# EAGLE schematic SynthV1 (EAGLE 9.3.2)
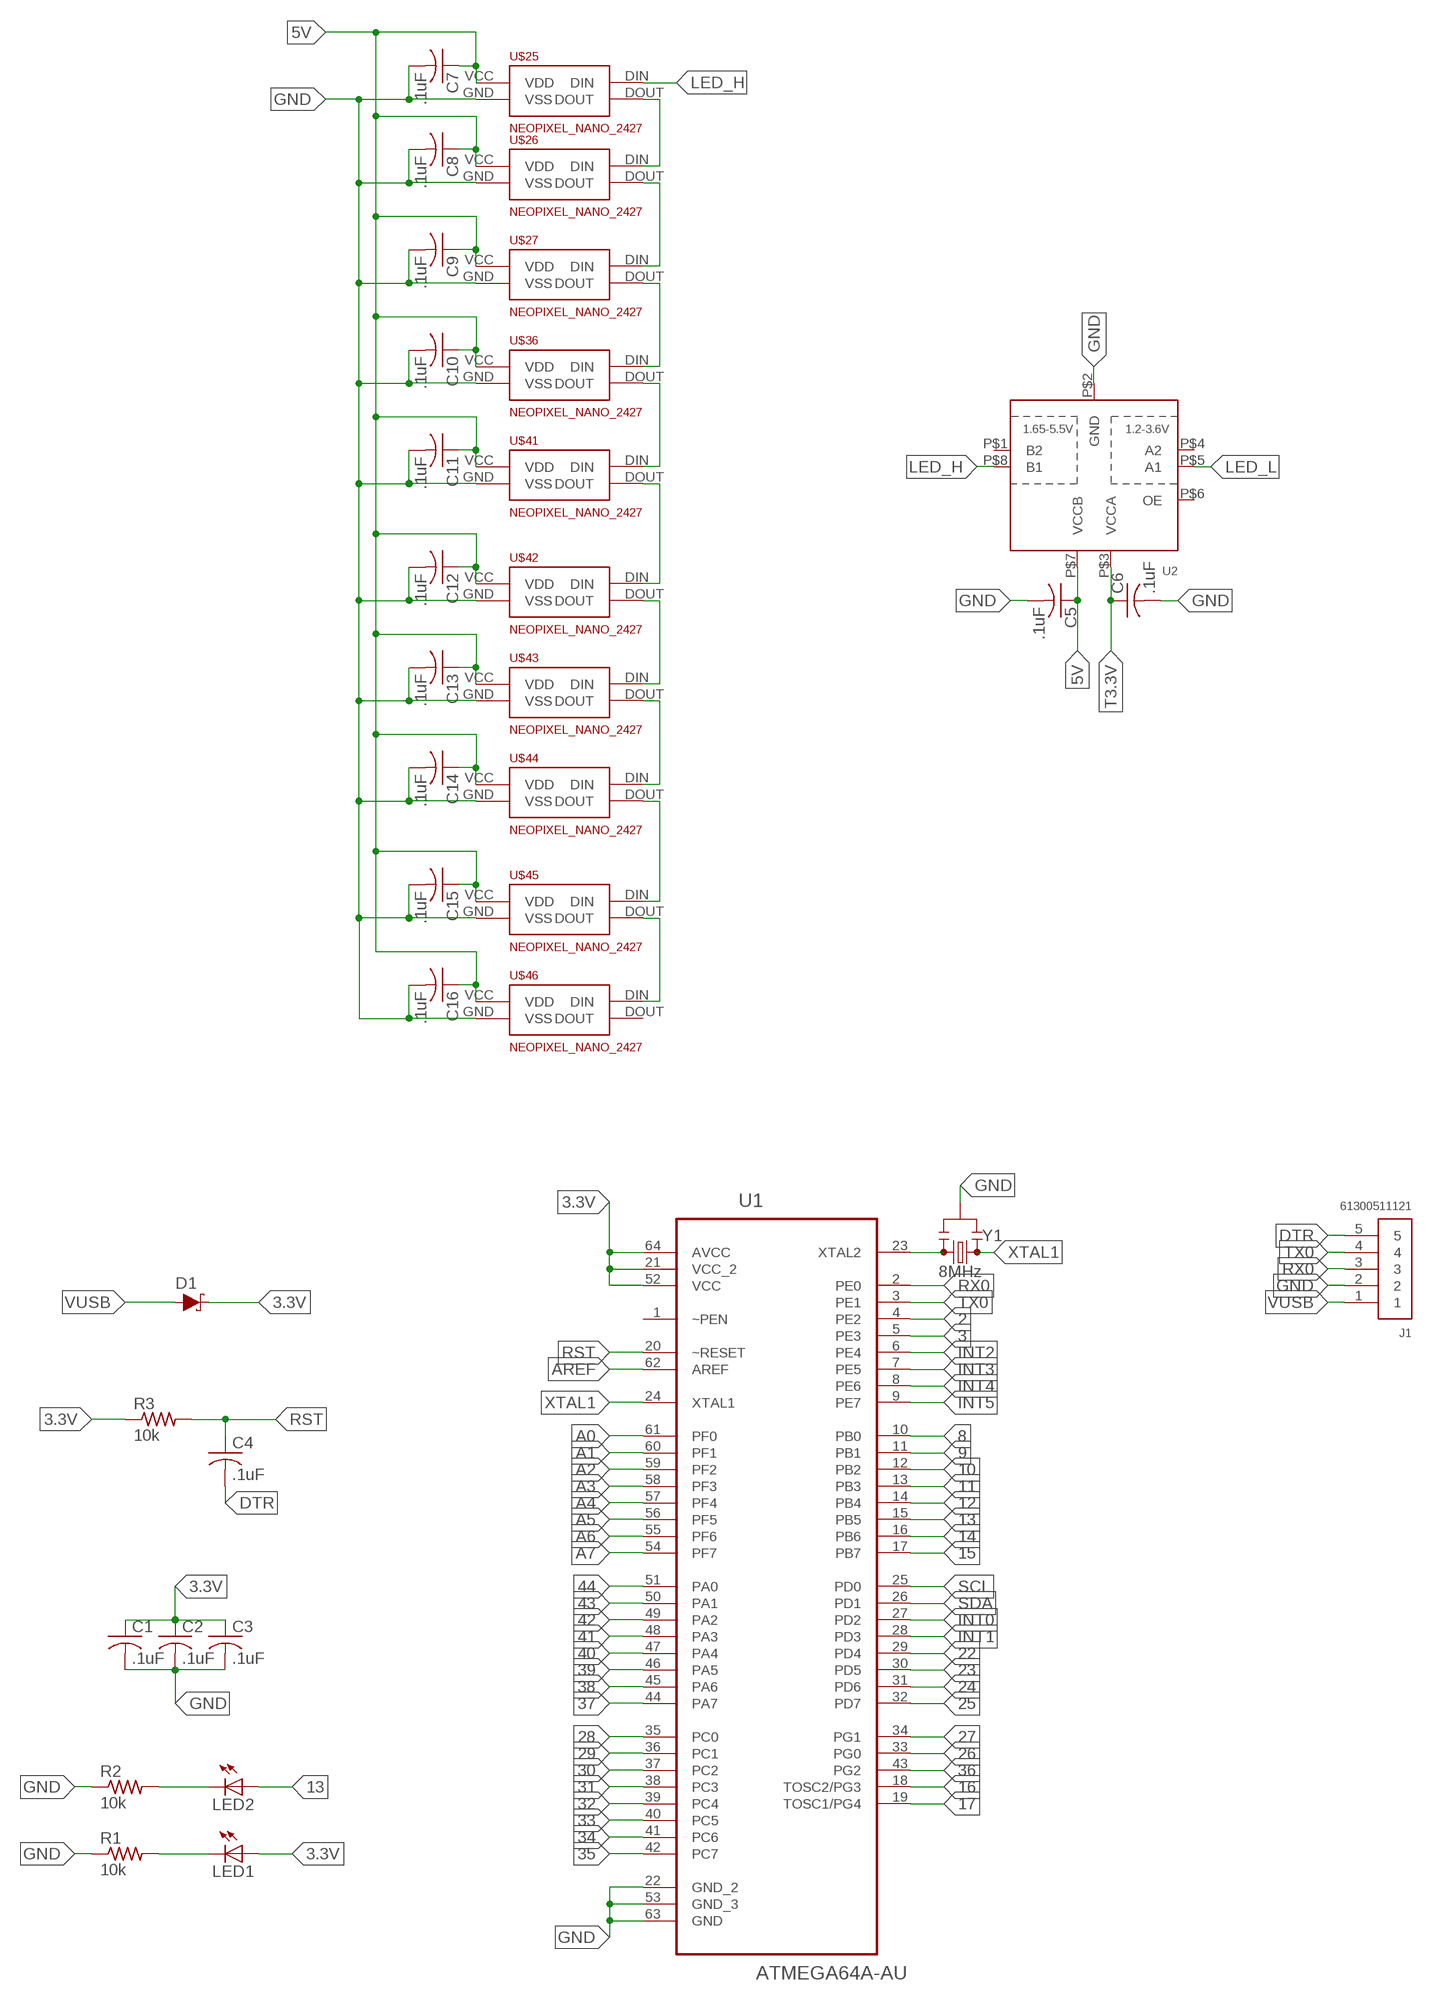
[diagram p0: schematic, sheet 1, part 1 of 2]
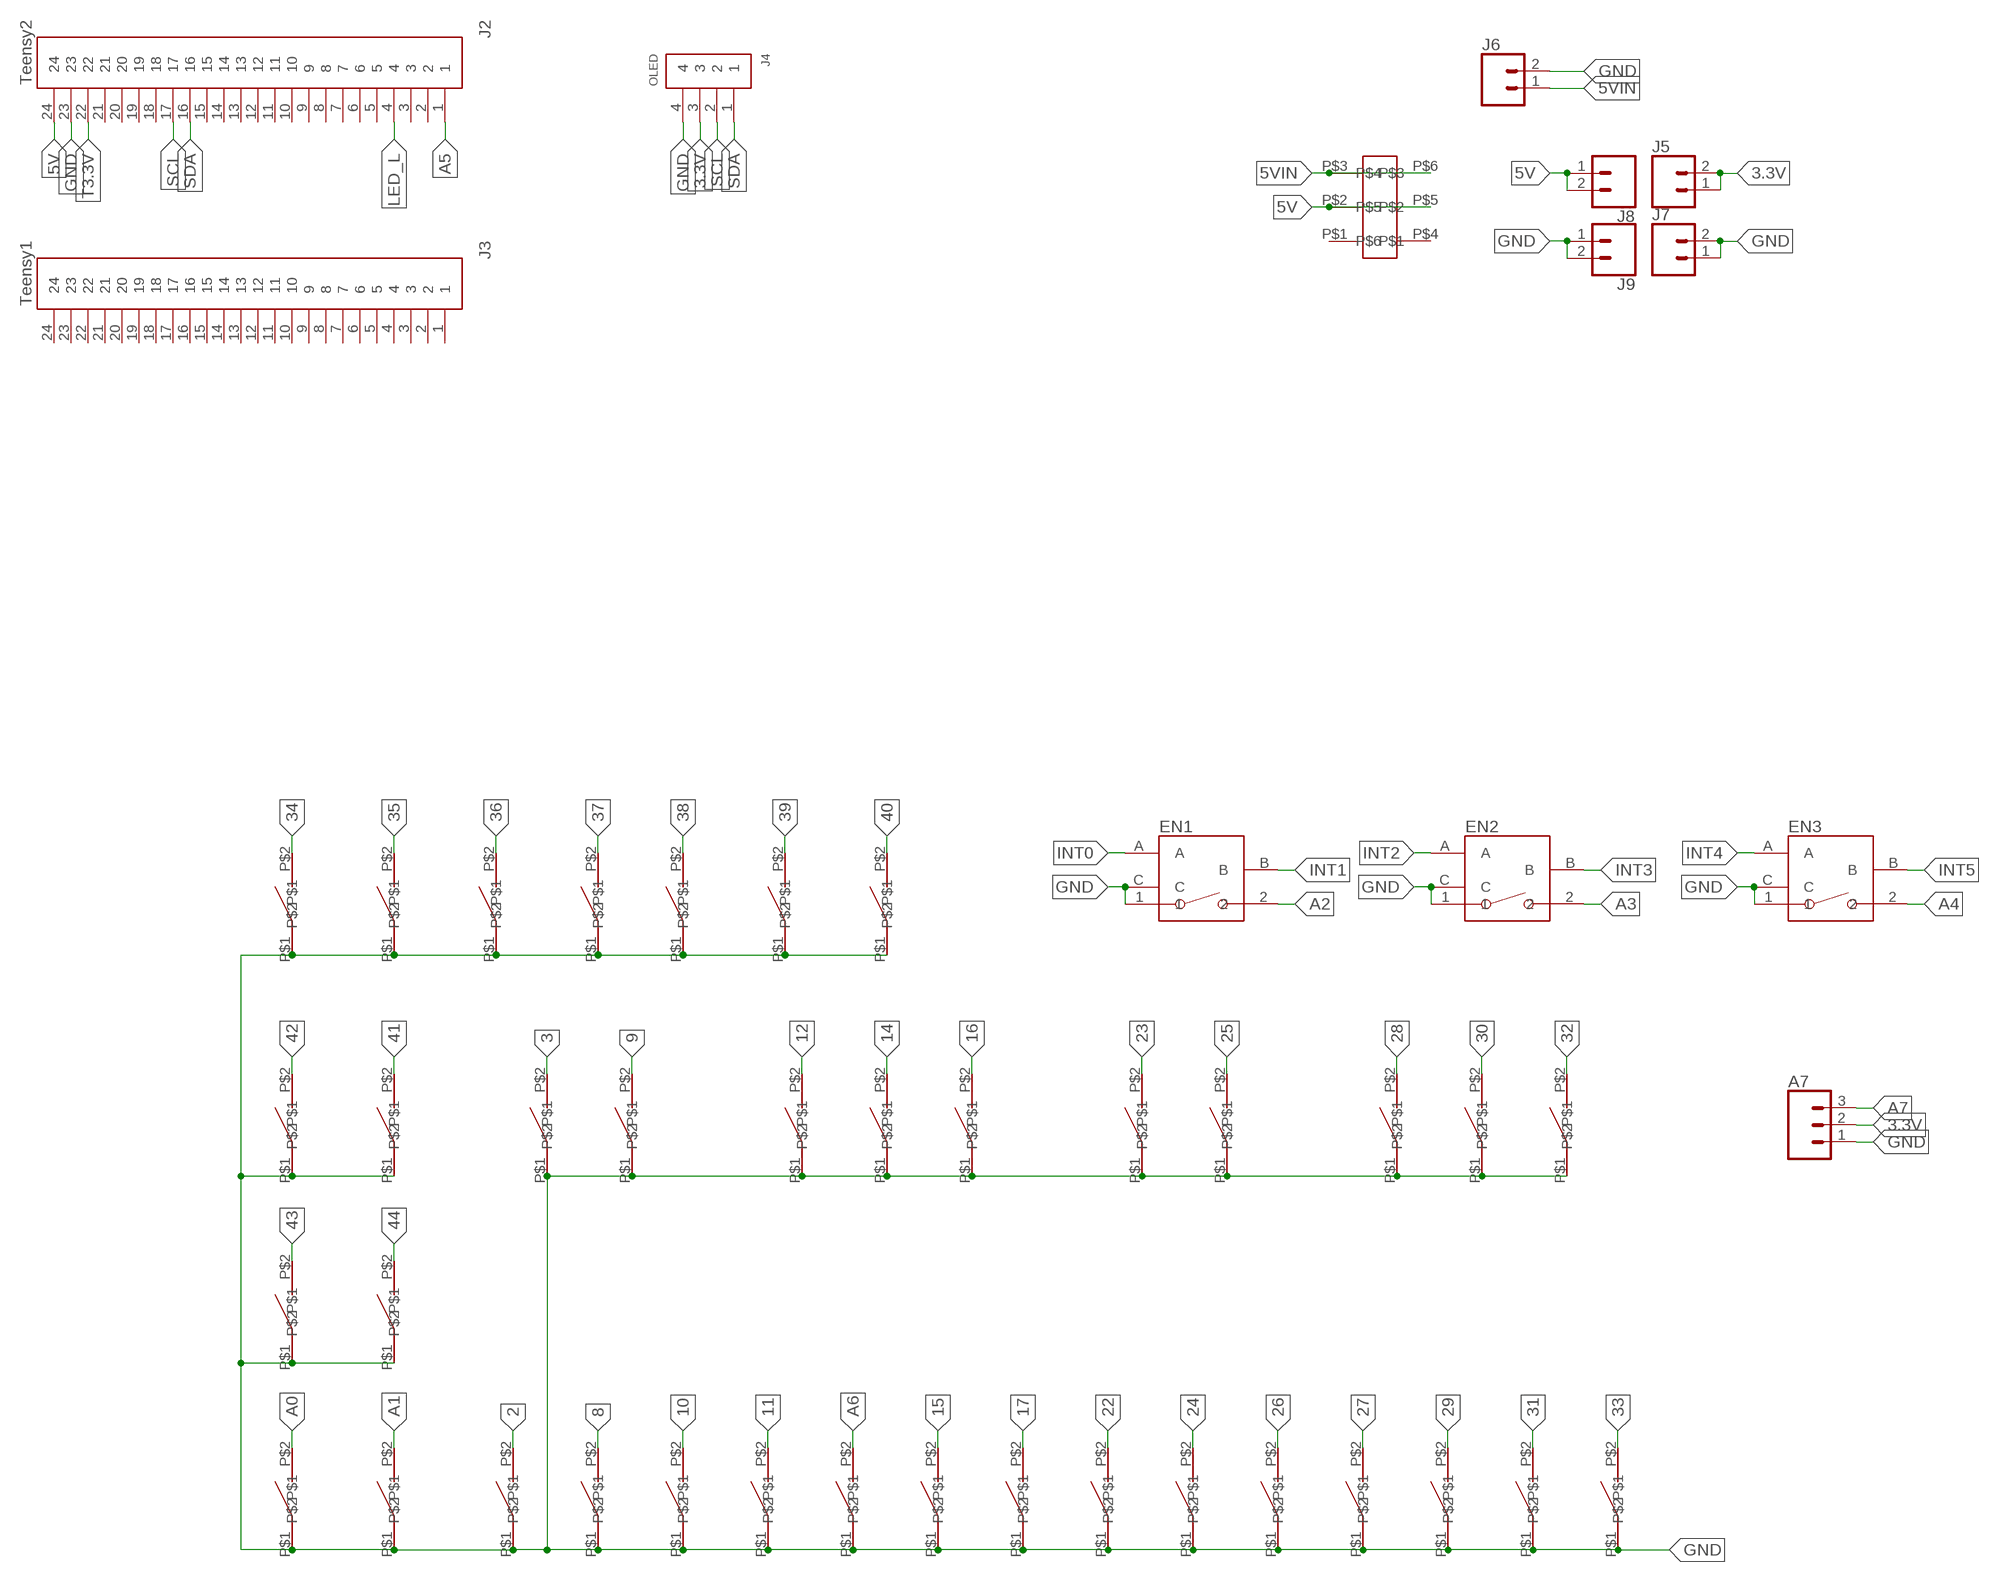
[diagram p1: schematic, sheet 1, part 2 of 2]

## Parts
38  BUTTONPAD  [BUTTONPAD]
A7  CONN_03  [1X03]
C1  .1uF  C-USC0805  [C0805]
C2  .1uF  C-USC0805  [C0805]
C3  .1uF  C-USC0805  [C0805]
C4  .1uF  C-USC0805  [C0805]
C5  .1uF  C-USC0805  [C0805]
C6  .1uF  C-USC0805  [C0805]
C7  .1uF  C-USC0805  [C0805]
C8  .1uF  C-USC0805  [C0805]
C9  .1uF  C-USC0805  [C0805]
C10  .1uF  C-USC0805  [C0805]
C11  .1uF  C-USC0805  [C0805]
C12  .1uF  C-USC0805  [C0805]
C13  .1uF  C-USC0805  [C0805]
C14  .1uF  C-USC0805  [C0805]
C15  .1uF  C-USC0805  [C0805]
C16  .1uF  C-USC0805  [C0805]
D1  0.5A/40V/420mV  DIODE-SCHOTTKY-PMEG4005EJ  [SOD-323]
EN1  PEC11R-4215K-S0024  [PEC11R-4215K-S0024]
EN2  PEC11R-4215K-S0024  [PEC11R-4215K-S0024]
EN3  PEC11R-4215K-S0024  [PEC11R-4215K-S0024]
J1  61300511121  [61300511121]
J2  Teensy2  61302411121  [61302411121]
J3  Teensy1  61302411121  [61302411121]
J4  OLED  61300411121  [61300411121]
J5  CONN_02  [1X02]
J6  CONN_02POLAR  [MOLEX-1X2]
J7  CONN_02  [1X02]
J8  CONN_02  [1X02]
J9  CONN_02  [1X02]
LED1  LEDCHIPLED_0805  [CHIPLED_0805]
LED2  LEDCHIPLED_0805  [CHIPLED_0805]
R1  10k  R-US_R0805  [R0805]
R2  10k  R-US_R0805  [R0805]
R3  10k  R-US_R0805  [R0805]
U1  ATMEGA64A-AU  [QFP80P1600X1600X120-64N]
U2  TXS0102  [VFSOP-8]
U$1  BUTTONPAD  [BUTTONPAD]
U$2  BUTTONPAD  [BUTTONPAD]
U$3  BUTTONPAD  [BUTTONPAD]
U$4  BUTTONPAD  [BUTTONPAD]
U$5  BUTTONPAD  [BUTTONPAD]
U$6  BUTTONPAD  [BUTTONPAD]
U$7  BUTTONPAD  [BUTTONPAD]
U$8  BUTTONPAD  [BUTTONPAD]
U$9  BUTTONPAD  [BUTTONPAD]
U$10  BUTTONPAD  [BUTTONPAD]
U$11  BUTTONPAD  [BUTTONPAD]
U$12  BUTTONPAD  [BUTTONPAD]
U$13  BUTTONPAD  [BUTTONPAD]
U$14  BUTTONPAD  [BUTTONPAD]
U$15  BUTTONPAD  [BUTTONPAD]
U$16  BUTTONPAD  [BUTTONPAD]
U$17  BUTTONPAD  [BUTTONPAD]
U$18  BUTTONPAD  [BUTTONPAD]
U$19  BUTTONPAD  [BUTTONPAD]
U$20  BUTTONPAD  [BUTTONPAD]
U$21  BUTTONPAD  [BUTTONPAD]
U$22  BUTTONPAD  [BUTTONPAD]
U$23  BUTTONPAD  [BUTTONPAD]
U$24  BUTTONPAD  [BUTTONPAD]
U$25  NEOPIXEL_NANO_2427  [SK6805-2427]
U$26  NEOPIXEL_NANO_2427  [SK6805-2427]
U$27  NEOPIXEL_NANO_2427  [SK6805-2427]
U$28  BUTTONPAD  [BUTTONPAD]
U$29  BUTTONPAD  [BUTTONPAD]
U$30  BUTTONPAD  [BUTTONPAD]
U$31  BUTTONPAD  [BUTTONPAD]
U$32  BUTTONPAD  [BUTTONPAD]
U$33  BUTTONPAD  [BUTTONPAD]
U$34  BUTTONPAD  [BUTTONPAD]
U$35  BUTTONPAD  [BUTTONPAD]
U$36  NEOPIXEL_NANO_2427  [SK6805-2427]
U$37  BUTTONPAD  [BUTTONPAD]
U$38  BUTTONPAD  [BUTTONPAD]
U$39  BUTTONPAD  [BUTTONPAD]
U$40  BUTTONPAD  [BUTTONPAD]
U$41  NEOPIXEL_NANO_2427  [SK6805-2427]
U$42  NEOPIXEL_NANO_2427  [SK6805-2427]
U$43  NEOPIXEL_NANO_2427  [SK6805-2427]
U$44  NEOPIXEL_NANO_2427  [SK6805-2427]
U$45  NEOPIXEL_NANO_2427  [SK6805-2427]
U$46  NEOPIXEL_NANO_2427  [SK6805-2427]
U$47  JS202011JAQN  [JS202011JAQN]
Y1  8MHz  RESONATOR-8MHZSMD_3.2X1.3  [RESONATOR-SMD-3.2X1.3]

## Nets
2: U1.4(PE2) U$1.P$2
3: U1.5(PE3) U$15.P$2
3.3V: A7.2 C1.1 C2.1 C3.1 D1.C J4.3 J5.1 J5.2 LED1.A R3.1 U1.21(VCC_2) U1.52(VCC) U1.64(AVCC)
5V: C5.1 C7.1 C8.1 C9.1 C10.1 C11.1 C12.1 C13.1 C14.1 C15.1 C16.1 J2.24 J8.1 J8.2 U2.P$7(VCCB) U$25.VCC(VDD) U$26.VCC(VDD) U$27.VCC(VDD) U$36.VCC(VDD) U$41.VCC(VDD) U$42.VCC(VDD) U$43.VCC(VDD) U$44.VCC(VDD) U$45.VCC(VDD) U$46.VCC(VDD) U$47.P$2 U$47.P$5
5VIN: J6.1 U$47.P$3 U$47.P$6
8: U1.10(PB0) U$2.P$2
9: U1.11(PB1) U$16.P$2
10: U1.12(PB2) U$3.P$2
11: U1.13(PB3) U$4.P$2
12: U1.14(PB4) U$17.P$2
13: LED2.A U1.15(PB5)
14: U1.16(PB6) U$18.P$2
15: U1.17(PB7) U$6.P$2
16: U1.18(TOSC2/PG3) U$19.P$2
17: U1.19(TOSC1/PG4) U$7.P$2
22: U1.29(PD4) U$8.P$2
23: U1.30(PD5) U$20.P$2
24: U1.31(PD6) U$9.P$2
25: U1.32(PD7) U$21.P$2
26: U1.33(PG0) U$10.P$2
27: U1.34(PG1) U$11.P$2
28: U1.35(PC0) U$22.P$2
29: U1.36(PC1) U$12.P$2
30: U1.37(PC2) U$23.P$2
31: U1.38(PC3) U$13.P$2
32: U1.39(PC4) U$24.P$2
33: U1.40(PC5) U$14.P$2
34: U1.41(PC6) U$37.P$2
35: U1.42(PC7) U$38.P$2
36: U1.43(PG2) U$39.P$2
37: U1.44(PA7) U$40.P$2
38: 38.P$2 U1.45(PA6)
39: U1.46(PA5) U$35.P$2
40: U1.47(PA4) U$34.P$2
41: U1.48(PA3) U$33.P$2
42: U1.49(PA2) U$29.P$2
43: U1.50(PA1) U$30.P$2
44: U1.51(PA0) U$31.P$2
A0: U1.61(PF0) U$32.P$2
A1: U1.60(PF1) U$28.P$2
A2: EN1.2 U1.59(PF2)
A3: EN2.2 U1.58(PF3)
A4: EN3.2 U1.57(PF4)
A5: J2.1 U1.56(PF5)
A6: U1.55(PF6) U$5.P$2
A7: A7.3 U1.54(PF7)
AREF: U1.62(AREF)
DTR: C4.2 J1.5
GND: 38.P$1 A7.1 C1.2 C2.2 C3.2 C5.2 C6.2 C7.2 C8.2 C9.2 C10.2 C11.2 C12.2 C13.2 C14.2 C15.2 C16.2 EN1.1 EN1.C EN2.1 EN2.C EN3.1 EN3.C J1.2 J2.23 J4.4 J6.2 J7.1 J7.2 J9.1 J9.2 R1.1 R2.1 U1.22(GND_2) U1.53(GND_3) U1.63(GND) U2.P$2(GND) U$1.P$1 U$2.P$1 U$3.P$1 U$4.P$1 U$5.P$1 U$6.P$1 U$7.P$1 U$8.P$1 U$9.P$1 U$10.P$1 U$11.P$1 U$12.P$1 U$13.P$1 U$14.P$1 U$15.P$1 U$16.P$1 U$17.P$1 U$18.P$1 U$19.P$1 U$20.P$1 U$21.P$1 U$22.P$1 U$23.P$1 U$24.P$1 U$25.GND(VSS) U$26.GND(VSS) U$27.GND(VSS) U$28.P$1 U$29.P$1 U$30.P$1 U$31.P$1 U$32.P$1 U$33.P$1 U$34.P$1 U$35.P$1 U$36.GND(VSS) U$37.P$1 U$38.P$1 U$39.P$1 U$40.P$1 U$41.GND(VSS) U$42.GND(VSS) U$43.GND(VSS) U$44.GND(VSS) U$45.GND(VSS) U$46.GND(VSS) Y1.2
INT0: EN1.A U1.27(PD2)
INT1: EN1.B U1.28(PD3)
INT2: EN2.A U1.6(PE4)
INT3: EN2.B U1.7(PE5)
INT4: EN3.A U1.8(PE6)
INT5: EN3.B U1.9(PE7)
LED_H: U2.P$8(B1) U$25.DIN
LED_L: J2.4 U2.P$5(A1)
N$1: U1.23(XTAL2) Y1.3
N$2: U$25.DOUT U$26.DIN
N$3: U$26.DOUT U$27.DIN
N$4: U$27.DOUT U$36.DIN
N$5: U$36.DOUT U$41.DIN
N$6: U$41.DOUT U$42.DIN
N$7: U$42.DOUT U$43.DIN
N$8: U$43.DOUT U$44.DIN
N$9: U$44.DOUT U$45.DIN
N$10: LED2.C R2.2
N$11: LED1.C R1.2
N$12: U$45.DOUT U$46.DIN
RST: C4.1 R3.2 U1.20(~RESET)
RX0: J1.3 U1.2(PE0)
SCL: J2.17 J4.2 U1.25(PD0)
SDA: J2.16 J4.1 U1.26(PD1)
T3.3V: C6.1 J2.22 U2.P$3(VCCA)
TX0: J1.4 U1.3(PE1)
VUSB: D1.A J1.1
XTAL1: U1.24(XTAL1) Y1.1
Unconnected: J2.2 J2.3 J2.5 J2.6 J2.7 J2.8 J2.9 J2.10 J2.11 J2.12 J2.13 J2.14 J2.15 J2.18 J2.19 J2.20 J2.21 J3.1 J3.2 J3.3 J3.4 J3.5 J3.6 J3.7 J3.8 J3.9 J3.10 J3.11 J3.12 J3.13 J3.14 J3.15 J3.16 J3.17 J3.18 J3.19 J3.20 J3.21 J3.22 J3.23 J3.24 U1.1(~PEN) U2.P$1(B2) U2.P$4(A2) U2.P$6(OE) U$46.DOUT U$47.P$1 U$47.P$4

## Library data of the parts
38 U$29 U$34 U$35 U$37-U$40 = ButtonContacts:BUTTONPAD; SPICEPREFIX: B
A7 = SparkFun-Connectors:CONN_03: Multi connection point. Often used as Generic Header-pin footprint for 0.1 inch spaced/style header connections On any of the 0.1 inch spaced packages, you can populate with these: Break Away Headers - Straight <https://www.sparkfun.com/products/116> (PRT-00116) Break Away Male Headers - Right Angle <https://www.sparkfun.com/products/553> (PRT-00553) Female Headers <https://www.sparkfun.com/products/115> (PRT-00115) Break Away Headers - Machine Pin <https://www.sparkfun.com/products/117> (PRT-00117) Break Away Female Headers - Swiss Machine Pin <https://www.sparkfun.com/products/743> (PRT-00743) Stackable Header - 3 Pin (Female, 0.1") <https://www.sparkfun.com/products/13875> (PRT-13875) For SCREWTERMINALS and SPRING TERMINALS visit here: Screw Terimnals on SparkFun.com <https://www.sparkfun.com/search/results?term=Screw+Terminals> (5mm/3.5mm/2.54mm spacing) This device is also useful as a general connection point to wire up your design to another part of your project. Our various solder wires solder well into these plated through hole pads. Hook-Up Wire - Assortment (Stranded, 22 AWG) <https://www.sparkfun.com/products/11375> (PRT-11375) Hook-Up Wire - Assortment (Solid Core, 22 AWG) <https://www.sparkfun.com/products/11367> (PRT-11367) View the entire wire category on our website here <https://www.sparkfun.com/categories/141> Special notes: Molex polarized connector foot print use with SKU : PRT-08232 with associated crimp pins and housings.
C1-C16 = adafruit:C-US: CAPACITOR, American symbol
D1 = SparkFun-DiscreteSemi:DIODE-SCHOTTKY: Schottky diode A Schottky diode is a semiconductor diode which has a low forward voltage drop and a very fast switching action.; PROD_ID: DIO-10955
EN1-EN3 = Encoders:PEC11R-4215K-S0024: ROTARY ENCODER MECHANICAL 24PPR Manufacturer's datasheet <https://www.bourns.com/docs/Product-Datasheets/PEC11R.pdf>; CREATED_BY: PCBLayout.com; DIGIKEY_PARTNO: PEC11R-4215K-S0024-ND; MANUFACTURER: Bourns Inc.; MPN: PEC11R-4215K-S0024; SPICEPREFIX: X
J1 = Headers:61300511121: CONN HEADER VERT 5POS 2.54MM Manufacturer's datasheet <https://katalog.we-online.de/em/datasheet/6130xx11121.pdf>; CREATED_BY: PCBLayout.com; DIGI_KEY_PART_NUMBER: 732-5318-ND; MANUFACTURER: Wurth Electronics Inc.; MPN: 61300511121
J2 J3 = Headers:61302411121: CONN HEADER VERT 24POS 2.54MM Manufacturer's datasheet <https://katalog.we-online.de/em/datasheet/6130xx11121.pdf>; CREATED_BY: PCBLayout.com; DIGIKEY_PART_NUMBER: 732-5331-ND; MANUFACTURER: Wurth Electronics Inc.; MPN: 61302411121
J4 = Headers:61300411121: CONN HEADER VERT 4POS 2.54MM Manufacturer's datasheet <https://katalog.we-online.de/em/datasheet/6130xx11121.pdf>; CREATED_BY: PCBLayout.com; DIGI_KEY_PART_NUMBER: 732-5317-ND; MANUFACTURER: Wurth Electronics Inc.; MPN: 61300411121
J5 J7-J9 = SparkFun-Connectors:CONN_02: Multi connection point. Often used as Generic Header-pin footprint for 0.1 inch spaced/style header connections On any of the 0.1 inch spaced packages, you can populate with these: Break Away Headers - Straight <https://www.sparkfun.com/products/116> (PRT-00116) Break Away Male Headers - Right Angle <https://www.sparkfun.com/products/553> (PRT-00553) Female Headers <https://www.sparkfun.com/products/115> (PRT-00115) Break Away Headers - Machine Pin <https://www.sparkfun.com/products/117> (PRT-00117) Break Away Female Headers - Swiss Machine Pin <https://www.sparkfun.com/products/743> (PRT-00743) For SCREWTERMINALS and SPRING TERMINALS visit here: Screw Terimnals on SparkFun.com <https://www.sparkfun.com/search/results?term=Screw+Terminals> (5mm/3.5mm/2.54mm spacing) This device is also useful as a general connection point to wire up your design to another part of your project. Our various solder wires solder well into these plated through hole pads. Hook-Up Wire - Assortment (Stranded, 22 AWG) <https://www.sparkfun.com/products/11375> (PRT-11375) Hook-Up Wire - Assortment (Solid Core, 22 AWG) <https://www.sparkfun.com/products/11367> (PRT-11367) View the entire wire category on our website here <https://www.sparkfun.com/categories/141> Special notes: Molex polarized connector foot print use with: PRT-08233 with associated crimp pins and housings. 2.54_SCREWTERM for use with PRT-10571. 3.5mm Screw Terminal footprints for PRT-08084 5mm Screw Terminal footprints for use with PRT-08432
J6 = SparkFun-Connectors:CONN_02: Multi connection point. Often used as Generic Header-pin footprint for 0.1 inch spaced/style header connections On any of the 0.1 inch spaced packages, you can populate with these: Break Away Headers - Straight <https://www.sparkfun.com/products/116> (PRT-00116) Break Away Male Headers - Right Angle <https://www.sparkfun.com/products/553> (PRT-00553) Female Headers <https://www.sparkfun.com/products/115> (PRT-00115) Break Away Headers - Machine Pin <https://www.sparkfun.com/products/117> (PRT-00117) Break Away Female Headers - Swiss Machine Pin <https://www.sparkfun.com/products/743> (PRT-00743) For SCREWTERMINALS and SPRING TERMINALS visit here: Screw Terimnals on SparkFun.com <https://www.sparkfun.com/search/results?term=Screw+Terminals> (5mm/3.5mm/2.54mm spacing) This device is also useful as a general connection point to wire up your design to another part of your project. Our various solder wires solder well into these plated through hole pads. Hook-Up Wire - Assortment (Stranded, 22 AWG) <https://www.sparkfun.com/products/11375> (PRT-11375) Hook-Up Wire - Assortment (Solid Core, 22 AWG) <https://www.sparkfun.com/products/11367> (PRT-11367) View the entire wire category on our website here <https://www.sparkfun.com/categories/141> Special notes: Molex polarized connector foot print use with: PRT-08233 with associated crimp pins and housings. 2.54_SCREWTERM for use with PRT-10571. 3.5mm Screw Terminal footprints for PRT-08084 5mm Screw Terminal footprints for use with PRT-08432; SF_ID: PRT-09918
LED1 LED2 = adafruit:LED: LED OSRAM: - CHIPLED LG R971, LG N971, LY N971, LG Q971, LY Q971, LO R971, LY R971 LH N974, LH R974 LS Q976, LO Q976, LY Q976 LO Q996 - Hyper CHIPLED LW Q18S LB Q993, LB Q99A, LB R99A - SideLED LS A670, LO A670, LY A670, LG A670, LP A670 LB A673, LV A673, LT A673, LW A673 LH A674 LY A675 LS A676, LA A676, LO A676, LY A676, LW A676 LS A679, LY A679, LG A679 - Hyper Micro SIDELED® LS Y876, LA Y876, LO Y876, LY Y876 LT Y87S - SmartLED LW L88C, LW L88S LB L89C, LB L89S, LG L890 LS L89K, LO L89K, LY L89K LS L896, LA L896, LO L896, LY L896 - TOPLED LS T670, LO T670, LY T670, LG T670, LP T670 LSG T670, LSP T670, LSY T670, LOP T670, LYG T670 LG T671, LOG T671, LSG T671 LB T673, LV T673, LT T673, LW T673 LH T674 LS T676, LA T676, LO T676, LY T676, LB T676, LH T676, LSB T676, LW T676 LB T67C, LV T67C, LT T67C, LS T67K, LO T67K, LY T67K, LW E67C LS E67B, LA E67B, LO E67B, LY E67B, LB E67C, LV E67C, LT E67C LW T67C LS T679, LY T679, LG T679 LS T770, LO T770, LY T770, LG T770, LP T770 LB T773, LV T773, LT T773, LW T773 LH T774 LS E675, LA E675, LY E675, LS T675 LS T776, LA T776, LO T776, LY T776, LB T776 LHGB T686 LT T68C, LB T68C - Hyper Mini TOPLED® LB M676 - Mini TOPLED Santana® LG M470 LS M47K, LO M47K, LY M47K Source: http://www.osram.convergy.de/
R1-R3 = audio amplifier example:R-US_: RESISTOR, American symbol
U1 = ATMEGA64A-AU:ATMEGA64A-AU: Microcontroller with Programmable Flash; ARROW_ELECTRONICS-PURCHASE-URL: https://snapeda.com/shop?store=Arrow+Electronics&id=681715; DESCRIPTION: AVR AVR® ATmega Microcontroller IC 8-Bit 16MHz 64KB (32K x 16) FLASH 64-TQFP (14x14); DIGI-KEY_PART_NUMBER: ATMEGA64A-AURTR-ND; DIGIKEY-PURCHASE-URL: https://snapeda.com/shop?store=DigiKey&id=681715; MF: Microchip; MOUSER-PURCHASE-URL: https://snapeda.com/shop?store=Mouser&id=681715; MP: ATMEGA64A-AU; PACKAGE: TQFP-64 Microchip
U2 = adafruit:TXS0102: 2-Bit Bi-Directional Level Shifter (I2C, etc.) Designed for I2C devices and has internal pullups. Not to be confused with TXB010x series. 1.2V-3.6V (VCCA) to 1.65V-5.5V (VCCB) bi-directional level shifter with auto direction sensing. Max data rate - 24Mbps (Push Pull), 2Mbps (Open Drain) Digikey: 296-21931-1-ND
U$1-U$24 U$28 U$30-U$33 = ButtonContacts:BUTTONPAD
U$25-U$27 U$36 U$41-U$46 = NeoPixel Nano 2427:NEOPIXEL_NANO_2427
U$47 = SMD Slide Switch:JS202011JAQN
Y1 = SparkFun-Clocks:RESONATOR-8MHZ: 8MHz Resonator Digikey Example <http://www.digikey.com/product-detail/en/murata-electronics-north-america/CSTCE10M0G55-R0/490-1196-1-ND/584633> Frequency: 8MHz Frequency Stability: ±0.2% Frequency Tolerance: ±0.5% Capacitance: 33pF SparkFun Products Arduino Pro Mini 328- 3.3V/8MHz <https://www.sparkfun.com/products/11114> SparkFun Digital Sandbox <https://www.sparkfun.com/products/12651>; PROD_ID: XTAL-08895